# Altium schematic sheet S03_SOM1_A_B.SchDoc: SOM1 A & B
size 381 x 241 mm; SheetNumber: 3; SheetTotal: 12
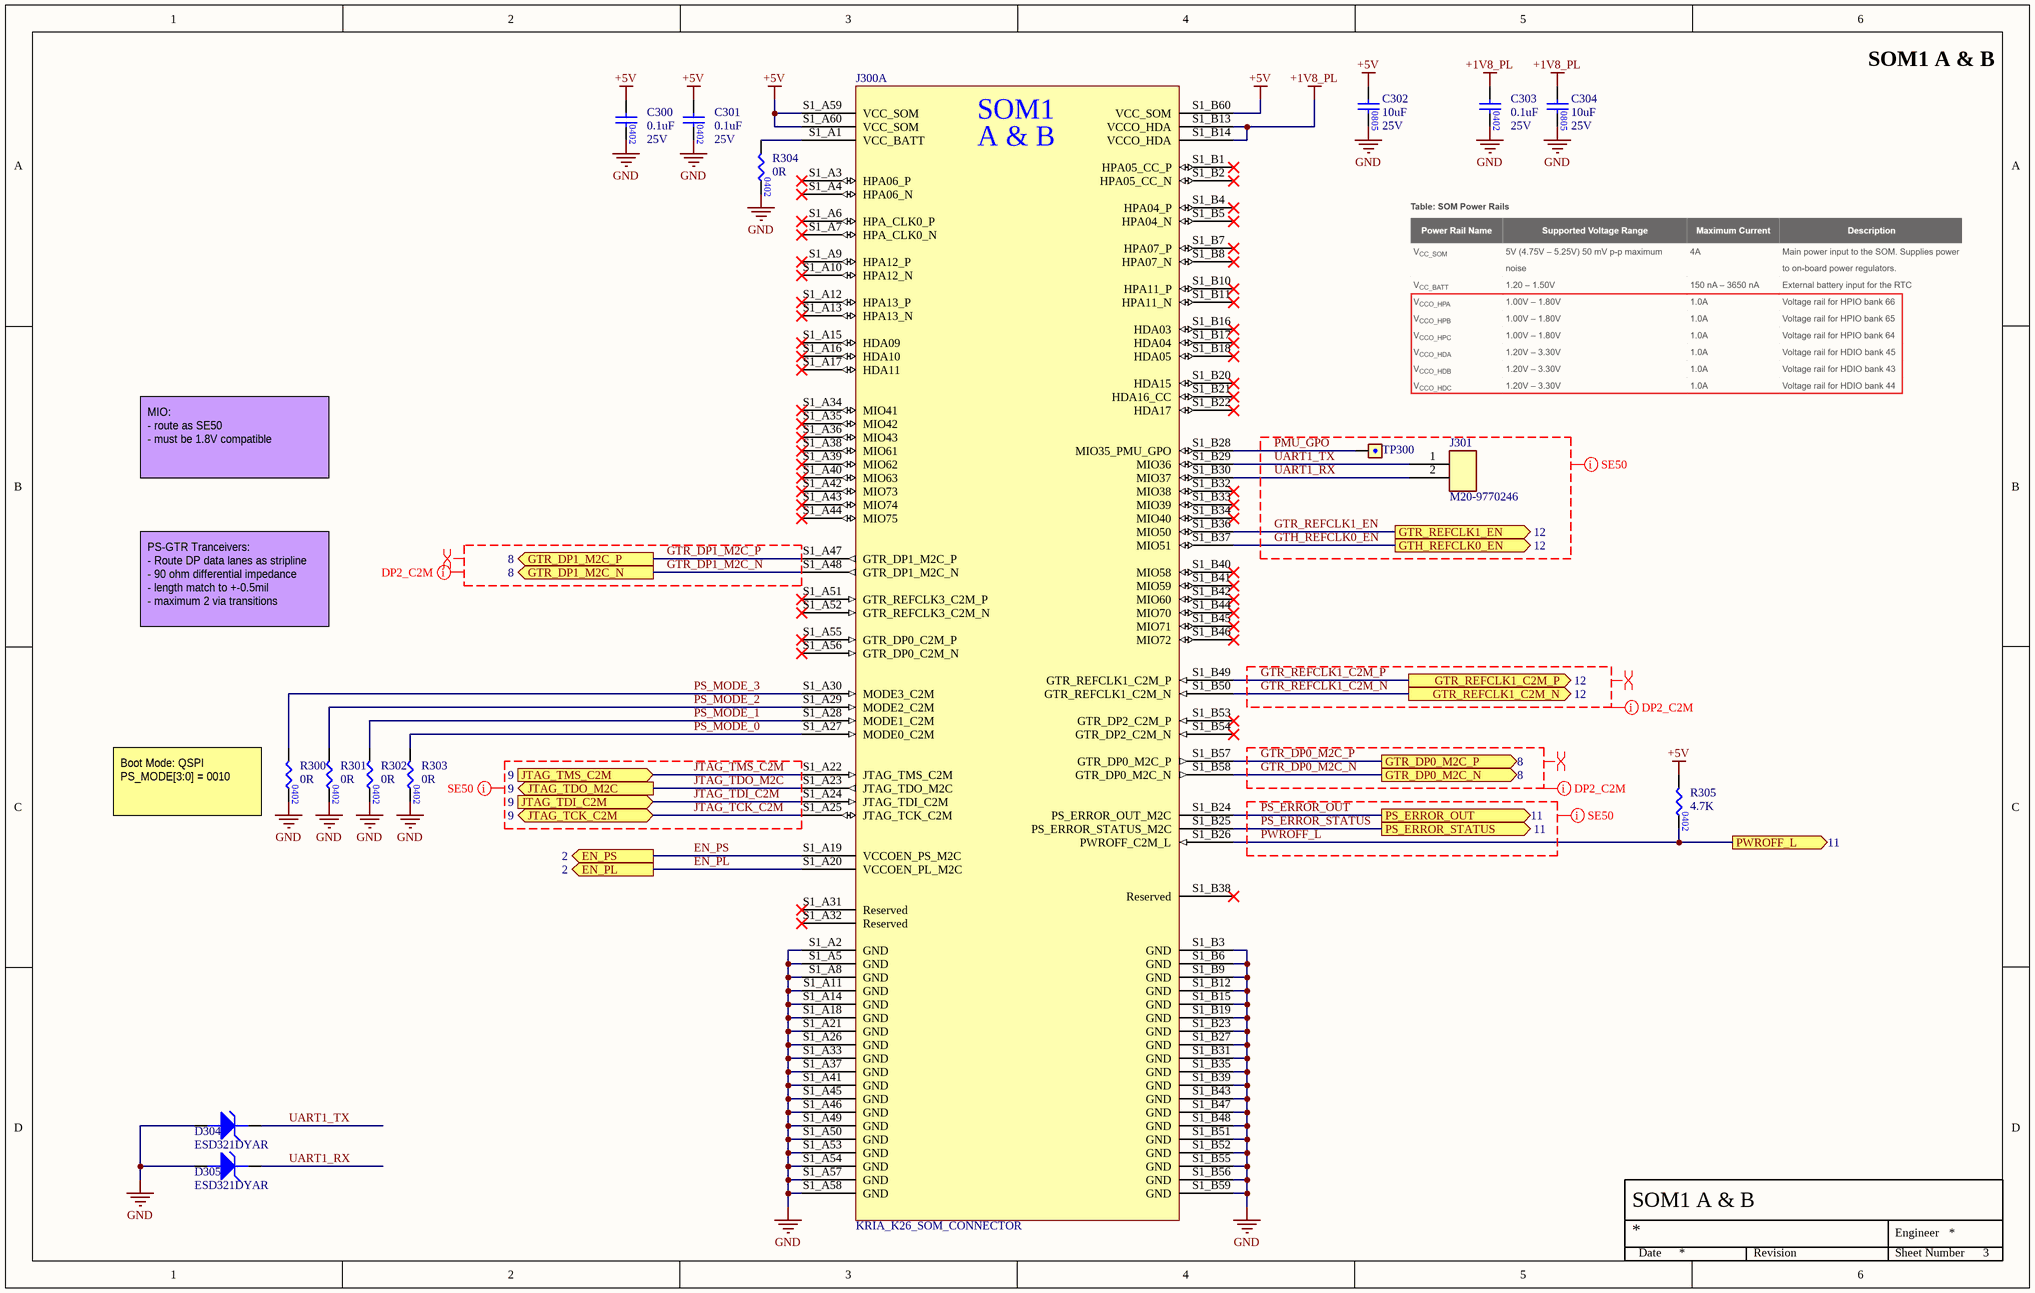
[diagram p0: S03_SOM1_A_B.SchDoc]

## Parts
C300  value 0.1uF  Voltage Rating: 25V  [CAP0402]  (hidden comment: CAP_0402)
C301  value 0.1uF  Voltage Rating: 25V  [CAP0402]  (hidden comment: CAP_0402)
C302  value 10uF  Voltage Rating: 25V  [CAP0805]  (hidden comment: CAP_0805)
C303  value 0.1uF  Voltage Rating: 25V  [CAP0402]  (hidden comment: CAP_0402)
C304  value 10uF  Voltage Rating: 25V  [CAP0805]  (hidden comment: CAP_0805)
D304  ESD321DYAR  [TI_SOD523]
D305  ESD321DYAR  [TI_SOD523]
J300  KRIA_K26_SOM_CONNECTOR  [KRIA_K26_SOM]  (part A of 4)
J301  M20-9770246  [61300211121]
R300  Resistance: 0R  [RES0402]  (hidden comment: RES_0402)
R301  Resistance: 0R  [RES0402]  (hidden comment: RES_0402)
R302  Resistance: 0R  [RES0402]  (hidden comment: RES_0402)
R303  Resistance: 0R  [RES0402]  (hidden comment: RES_0402)
R304  Resistance: 0R  [RES0402]  (hidden comment: RES_0402)
R305  Resistance: 4.7K  [RES0402]  (hidden comment: RES_0402)
TP300  1mm Round Pad Testpoint  [TP_1MM]  (value not drawn)

## Ports
EN_PL (out, see 2), EN_PS (out, see 2), GTH_REFCLK0_EN (out, see 12), GTR_DP0_M2C_N (out, see 8), GTR_DP0_M2C_P (out, see 8), GTR_DP1_M2C_N (out, see 8), GTR_DP1_M2C_P (out, see 8), GTR_REFCLK1_C2M_N (out, see 12), GTR_REFCLK1_C2M_P (out, see 12), GTR_REFCLK1_EN (out, see 12), JTAG_TCK_C2M (bidir, see 9), JTAG_TDI_C2M (in, see 9), JTAG_TDO_M2C (out, see 9), JTAG_TMS_C2M (in, see 9), PS_ERROR_OUT (out, see 11), PS_ERROR_STATUS (out, see 11), PWROFF_L (out, see 11)

## Nets
+1V8_PL: C303.1 C304.1 J300.S1_B13(VCCO_HDA) J300.S1_B14(VCCO_HDA)
+5V: C300.1 C301.1 C302.1 J300.S1_A59(VCC_SOM) J300.S1_A60(VCC_SOM) J300.S1_B60(VCC_SOM) R305.1
GND: C300.2 C301.2 C302.2 C303.2 C304.2 D304.A(Anode) D305.A(Anode) J300.S1_A2(GND) J300.S1_A5(GND) J300.S1_A8(GND) J300.S1_A11(GND) J300.S1_A14(GND) J300.S1_A18(GND) J300.S1_A21(GND) J300.S1_A26(GND) J300.S1_A33(GND) J300.S1_A37(GND) J300.S1_A41(GND) J300.S1_A45(GND) J300.S1_A46(GND) J300.S1_A49(GND) J300.S1_A50(GND) J300.S1_A53(GND) J300.S1_A54(GND) J300.S1_A57(GND) J300.S1_A58(GND) J300.S1_B3(GND) J300.S1_B6(GND) J300.S1_B9(GND) J300.S1_B12(GND) J300.S1_B15(GND) J300.S1_B19(GND) J300.S1_B23(GND) J300.S1_B27(GND) J300.S1_B31(GND) J300.S1_B35(GND) J300.S1_B39(GND) J300.S1_B43(GND) J300.S1_B47(GND) J300.S1_B48(GND) J300.S1_B51(GND) J300.S1_B52(GND) J300.S1_B55(GND) J300.S1_B56(GND) J300.S1_B59(GND) R300.2 R301.2 R302.2 R303.2 R304.2
EN_PL: J300.S1_A20(VCCOEN_PL_M2C) ; port EN_PL
EN_PS: J300.S1_A19(VCCOEN_PS_M2C) ; port EN_PS
GTH_REFCLK0_EN: J300.S1_B37(MIO51) ; port GTH_REFCLK0_EN
GTR_DP0_M2C_N: J300.S1_B58(GTR_DP0_M2C_N) ; port GTR_DP0_M2C_N
GTR_DP0_M2C_P: J300.S1_B57(GTR_DP0_M2C_P) ; port GTR_DP0_M2C_P
GTR_DP1_M2C_N: J300.S1_A48(GTR_DP1_M2C_N) ; port GTR_DP1_M2C_N
GTR_DP1_M2C_P: J300.S1_A47(GTR_DP1_M2C_P) ; port GTR_DP1_M2C_P
GTR_REFCLK1_C2M_N: J300.S1_B50(GTR_REFCLK1_C2M_N) ; port GTR_REFCLK1_C2M_N
GTR_REFCLK1_C2M_P: J300.S1_B49(GTR_REFCLK1_C2M_P) ; port GTR_REFCLK1_C2M_P
GTR_REFCLK1_EN: J300.S1_B36(MIO50) ; port GTR_REFCLK1_EN
JTAG_TCK_C2M: J300.S1_A25(JTAG_TCK_C2M) ; port JTAG_TCK_C2M
JTAG_TDI_C2M: J300.S1_A24(JTAG_TDI_C2M) ; port JTAG_TDI_C2M
JTAG_TDO_M2C: J300.S1_A23(JTAG_TDO_M2C) ; port JTAG_TDO_M2C
JTAG_TMS_C2M: J300.S1_A22(JTAG_TMS_C2M) ; port JTAG_TMS_C2M
PMU_GPO: J300.S1_B28(MIO35_PMU_GPO) TP300.1
PS_ERROR_OUT: J300.S1_B24(PS_ERROR_OUT_M2C) ; port PS_ERROR_OUT
PS_ERROR_STATUS: J300.S1_B25(PS_ERROR_STATUS_M2C) ; port PS_ERROR_STATUS
PS_MODE_0: J300.S1_A27(MODE0_C2M) R303.1
PS_MODE_1: J300.S1_A28(MODE1_C2M) R302.1
PS_MODE_2: J300.S1_A29(MODE2_C2M) R301.1
PS_MODE_3: J300.S1_A30(MODE3_C2M) R300.1
PWROFF_L: J300.S1_B26(PWROFF_C2M_L) R305.2 ; port PWROFF_L
UART1_RX: D305.K(Cathode) J300.S1_B30(MIO37) J301.2
UART1_TX: D304.K(Cathode) J300.S1_B29(MIO36) J301.1
NetJ300_S1_A1: J300.S1_A1(VCC_BATT) R304.1

Not connected (* = marked no-connect by the designer): J300 S1_A3(HPA06_P)* S1_A4(HPA06_N)* S1_A6(HPA_CLK0_P)* S1_A7(HPA_CLK0_N)* S1_A9(HPA12_P)* S1_A10(HPA12_N)* S1_A12(HPA13_P)* S1_A13(HPA13_N)* S1_A15(HDA09)* S1_A16(HDA10)* S1_A17(HDA11)* S1_A31(Reserved)* S1_A32(Reserved)* S1_A34(MIO41)* S1_A35(MIO42)* S1_A36(MIO43)* S1_A38(MIO61)* S1_A39(MIO62)* S1_A40(MIO63)* S1_A42(MIO73)* S1_A43(MIO74)* S1_A44(MIO75)* S1_A51(GTR_REFCLK3_C2M_P)* S1_A52(GTR_REFCLK3_C2M_N)* S1_A55(GTR_DP0_C2M_P)* S1_A56(GTR_DP0_C2M_N)* S1_B1(HPA05_CC_P)* S1_B2(HPA05_CC_N)* S1_B4(HPA04_P)* S1_B5(HPA04_N)* S1_B7(HPA07_P)* S1_B8(HPA07_N)* S1_B10(HPA11_P)* S1_B11(HPA11_N)* S1_B16(HDA03)* S1_B17(HDA04)* S1_B18(HDA05)* S1_B20(HDA15)* S1_B21(HDA16_CC)* S1_B22(HDA17)* S1_B32(MIO38)* S1_B33(MIO39)* S1_B34(MIO40)* S1_B38(Reserved)* S1_B40(MIO58)* S1_B41(MIO59)* S1_B42(MIO60)* S1_B44(MIO70)* S1_B45(MIO71)* S1_B46(MIO72)* S1_B53(GTR_DP2_C2M_P)* S1_B54(GTR_DP2_C2M_N)*

## Layout directives
differential pair; differential pair class DIFFPAIR90: GTR_DP0_M2C_N, GTR_DP0_M2C_P, GTR_DP1_M2C_N, GTR_DP1_M2C_P
net class DIFFPAIR_DP: GTR_DP0_M2C_N, GTR_DP0_M2C_P, GTR_DP1_M2C_N, GTR_DP1_M2C_P
net class SE50: GTH_REFCLK0_EN, GTR_REFCLK1_EN, JTAG_TCK_C2M, JTAG_TDI_C2M, JTAG_TDO_M2C, JTAG_TMS_C2M, PMU_GPO, PS_ERROR_OUT, PS_ERROR_STATUS, PWROFF_L, UART1_RX, UART1_TX
differential pair; differential pair class DIFFPAIR100: GTR_REFCLK1_C2M_N, GTR_REFCLK1_C2M_P
net class DIFFPAIR_REFCLK: GTR_REFCLK1_C2M_N, GTR_REFCLK1_C2M_P

## Notes on the sheet
- MIO:
  - route as SE50
  - must be 1.8V compatible
- PS-GTR Tranceivers:
  - Route DP data lanes as stripline
  - 90 ohm differential impedance
  - length match to +-0.5mil
  - maximum 2 via transitions
- (near R300) Boot Mode: QSPI
  PS_MODE[3:0] = 0010
- Engineer
- Date
- Revision
- Sheet Number
- (in symbol KRIA_K26_SOM, part A) SOM1; A & B

## Library data of the parts
C300 C301 C303 = CAP_CL05A104KA5NNNC: CAP CER 0.1UF 25V X5R 0402; Manufacturer: Samsung Electro-Mechanics; Tolerance: 10%; Manufacturer Part Number 1: CL05A104KA5NNNC; Case/Package: 0402; Mounting Type: Surface Mount; Temperature Coefficient: X5R
C302 C304 = CAP_CL21A106KAYNNNE: CAP CER 10UF 25V X5R 0805; Manufacturer: Samsung Electro-Mechanics; Tolerance: 10%; Manufacturer Part Number 1: CL21A106KAYNNNE; Case/Package: 0805; Mounting Type: Surface Mount; Temperature Coefficient: X5R
D304 D305 = ESD321DYAR: TVS DIODE 3.6VWM 6.3VC SOT5X3; Manfacturer Part Number: ESD321DYAR
J300 = KRIA_K26_SOM: 2 x 240 pos Samtec REF-226081-01; Number of Positions: 480; Manufacturer: Samtec; Manufacturer Part NUmber: REF-226081-01; Number of Rows: 8
J301 = M20-9770246: CONN HEADER VERT 2POS 2.54MM; Positions: 2; Rows: 1; Manufacturer Part Number: M20-9770246
R300-R304 = .RES_RC0402JR-070RL: RES 0 OHM JUMPER 1/16W 0402; Manufacturer: YAGEO; Tolerance: 1%; Manufacturer Part Number: RC0402JR-070RL; Case/Package: 0402
R305 = .RES_RC0402FR-074K7L: RES 4.7K OHM 1% 1/16W 0402; Manufacturer: YAGEO; Manufacturer Part Number: RC0402FR-074K7L; Case/Package: 0402; Tolerance: 1%
TP300 = TP_1MM